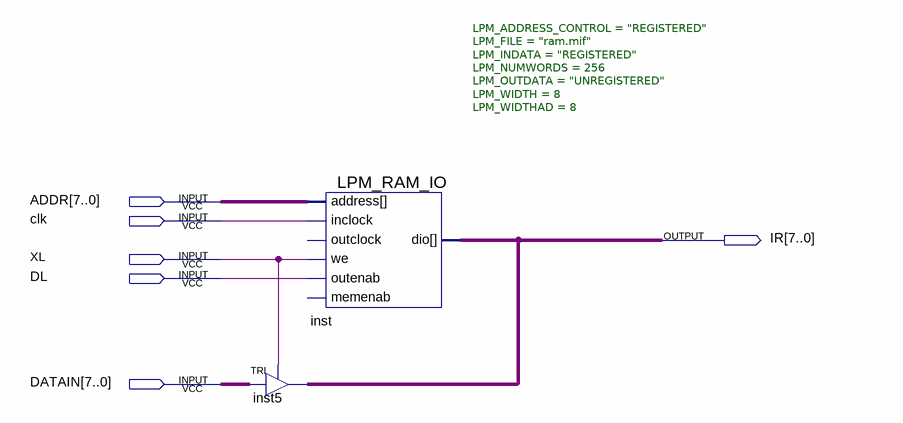
[diagram p0: schematic sheet]
// Quartus schematic ram.bdf as structural Verilog: 2 symbols, 6 pins
module ram (
  input  [7:0] ADDR,
  input  clk,
  input  XL,
  input  DL,
  input  [7:0] DATAIN,
  output [7:0] IR
);

  TRI inst5[7:0] (.IN(DATAIN), .OE(XL), .OUT(IR));
  LPM_RAM_IO #(.LPM_ADDRESS_CONTROL("REGISTERED"), .LPM_FILE("ram.mif"), .LPM_INDATA("REGISTERED"), .LPM_NUMWORDS(256), .LPM_OUTDATA("UNREGISTERED"), .LPM_WIDTH(8), .LPM_WIDTHAD(8)) inst (
    .address(ADDR), .inclock(clk), .we(XL), .outenab(DL), .dio(IR));  // open: outclock, memenab
endmodule
